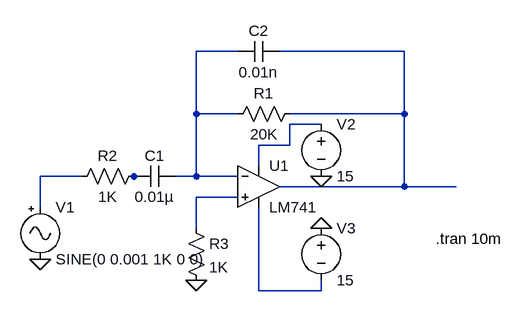
[diagram p0: schematic opamp differentiator.asc]
opamp differentiator.asc, the LTspice schematic file:
Version 4
SHEET 1 880 680
WIRE 288 128 224 128
WIRE 544 128 352 128
WIRE 224 224 224 128
WIRE 288 224 224 224
WIRE 544 224 544 128
WIRE 544 224 368 224
WIRE 416 240 368 240
WIRE 368 272 368 240
WIRE 368 272 320 272
WIRE 320 304 320 272
WIRE 48 320 -16 320
WIRE 144 320 128 320
WIRE 224 320 224 224
WIRE 224 320 192 320
WIRE 288 320 224 320
WIRE 544 336 544 224
WIRE 544 336 352 336
WIRE 624 336 544 336
WIRE 288 352 224 352
WIRE -16 368 -16 320
WIRE 224 400 224 352
WIRE 320 496 320 368
WIRE 416 496 416 480
WIRE 416 496 320 496
FLAG 416 400 0
FLAG 416 320 0
FLAG 224 480 0
FLAG -16 448 0
SYMBOL LM741 320 272 R0
SYMATTR InstName U1
SYMBOL cap 192 304 R90
WINDOW 0 0 32 VBottom 2
WINDOW 3 32 32 VTop 2
SYMATTR InstName C1
SYMATTR Value 0.01µ
SYMATTR SpiceLine Rser=13.7m Lser=0 mfg="   ---" pn="   ---" type="   ---"
SYMBOL res 384 208 R90
WINDOW 0 0 56 VBottom 2
WINDOW 3 32 56 VTop 2
SYMATTR InstName R1
SYMATTR Value 20K
SYMBOL Misc/signal -16 352 R0
SYMATTR InstName V1
SYMATTR Value SINE(0 0.001 1K 0 0)
SYMBOL voltage 416 224 R0
SYMATTR InstName V2
SYMATTR Value 15
SYMBOL voltage 416 384 R0
SYMATTR InstName V3
SYMATTR Value 15
SYMBOL res 144 304 R90
WINDOW 0 0 56 VBottom 2
WINDOW 3 32 56 VTop 2
SYMATTR InstName R2
SYMATTR Value 1K
SYMBOL res 208 384 R0
SYMATTR InstName R3
SYMATTR Value 1K
SYMBOL cap 352 112 R90
WINDOW 0 0 32 VBottom 2
WINDOW 3 32 32 VTop 2
SYMATTR InstName C2
SYMATTR Value 0.01n
SYMATTR SpiceLine Rser=3.045 Lser=0 mfg="   ---" pn="   ---" type="   ---"
TEXT 592 416 Left 2 !.tran 10m

The netlist it stands for:
* opamp differentiator.asc
XU1 N006 N001 N003 N007 N002 LM741  ; pins In+ In- V+ V- OUT
C1 N001 N005 0.01µ Rser=13.7m Lser=0 mfg="   ---" pn="   ---" type="   ---"
R1 N002 N001 20K
V1 N004 0 SINE(0 0.001 1K 0 0)
V2 N003 0 15
V3 0 N007 15
R2 N005 N004 1K
R3 N006 0 1K
C2 N002 N001 0.01n Rser=3.045 Lser=0 mfg="   ---" pn="   ---" type="   ---"
.tran 10m
.lib LM741.lib
.backanno
.end